# Altium schematic sheet 02.Template_connection.SchDoc
size 209 x 297 mm; Author: Мурашкин Д.В.; DocumentNumber: AB_BUSM_D01.R1; SheetNumber: 3; SheetTotal: 20; Scale: 1:1; Letter1Column: Э; PartName: Подключение к планшету; CompanyName: Innoforce.kz; DocumentsNumber: AB_BUSM_D01.R1
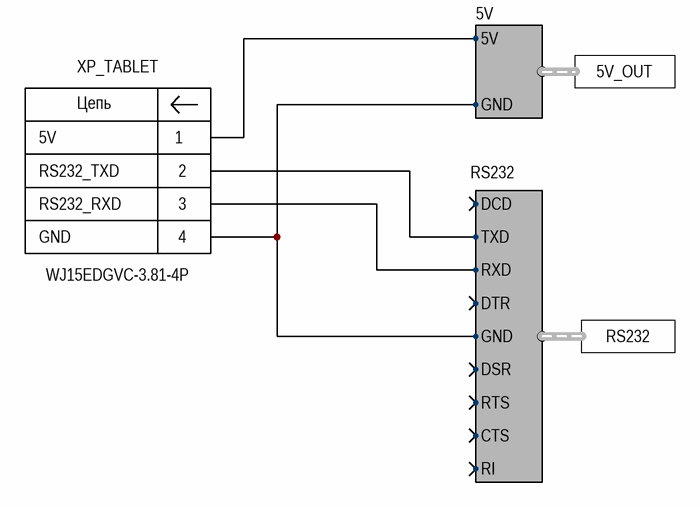
[diagram p0: 02.Template_connection.SchDoc]

## Parts
XP_TABLET  WJ15EDGVC-3.81-4P  [CON-TER-PLG-3.81-4V-TH-A-N]

## Ports
5V_OUT (harness 5V), RS232 (harness RS232)

## Harnesses
RS232: RXD, TXD, GND, DCD, DTR, DSR, RTS, CTS, RI
5V: 5V, GND

## Nets
NetXP_TABLET_1: XP_TABLET.1 ; port 5V_OUT.5V
NetXP_TABLET_2: XP_TABLET.2 ; port RS232.TXD
NetXP_TABLET_3: XP_TABLET.3 ; port RS232.RXD
NetXP_TABLET_4: XP_TABLET.4 ; port RS232.GND, port 5V_OUT.GND

## Notes on the sheet
- 5V
- RS232_TXD
- RS232_RXD
- GND
- Подп. и дата
- Инв. № дубл.
- Взам. инв. №
- Инв. № подл.
- Изм.
- Лист
- № докум.
- Подп.
- Дата
- 2.106-A4
- Копировал
- Формат А4
- (in symbol WJ15EDGVC-3.81-4P) Цепь

## Library data of the parts
XP_TABLET = WJ15EDGVC-3.81-4P: TERM BLOCK 3.81 VERT BOARD; Manufacturer: Ningbo Kangnex Elec; Pitch: 3.81; Row spacing: 0; Positions: 4; Rows: 1; Placing: Vertical; Series name: Pluggable Terminal Blocks; Connector type: Terminal plugable; Shrouding: 4 Wall; Voltage rating: 300; Current rating: 8.0; Group: Mechanical; Component: Connectors; System: Connector; Item ID: WJ15EDGVC-3.81-4P; Part name: WJ15EDGVC-3.81-4P; Package: CON-TER-PLG-3.81-4V-TH-A; Contact type: Male pin; Series: WJ15EDG; Fastening type: Friction lock; Connector style: Board; Insulation color: Green; Contact finish: Tin; Operating temperature Min: -40; Operating temperature Max: +105; Width: 7.00; Length: 16.12; Height: 9.15; Mounting type: Through hole; Supplier 1: LCSC; Supplier Part Number 1: C8410; Datasheet URL: https://datasheet.lcsc.com/lcsc/1912251633_Ningbo-Kangnex-Elec-WJ15EDGVC-3-81-4P_C8410.pdf?_gl=1*1co0dqv*_ga*MTY0NDk5MzUwOC4xNzA4NzUzMTA0*_ga_98M84MKSZH*MTcwODk4MDUzOS4xMy4wLjE3MDg5ODA5NjYuNjAuMC4w; Component URL: http://kangnex.com/product/0-70.html; Category: Terminal